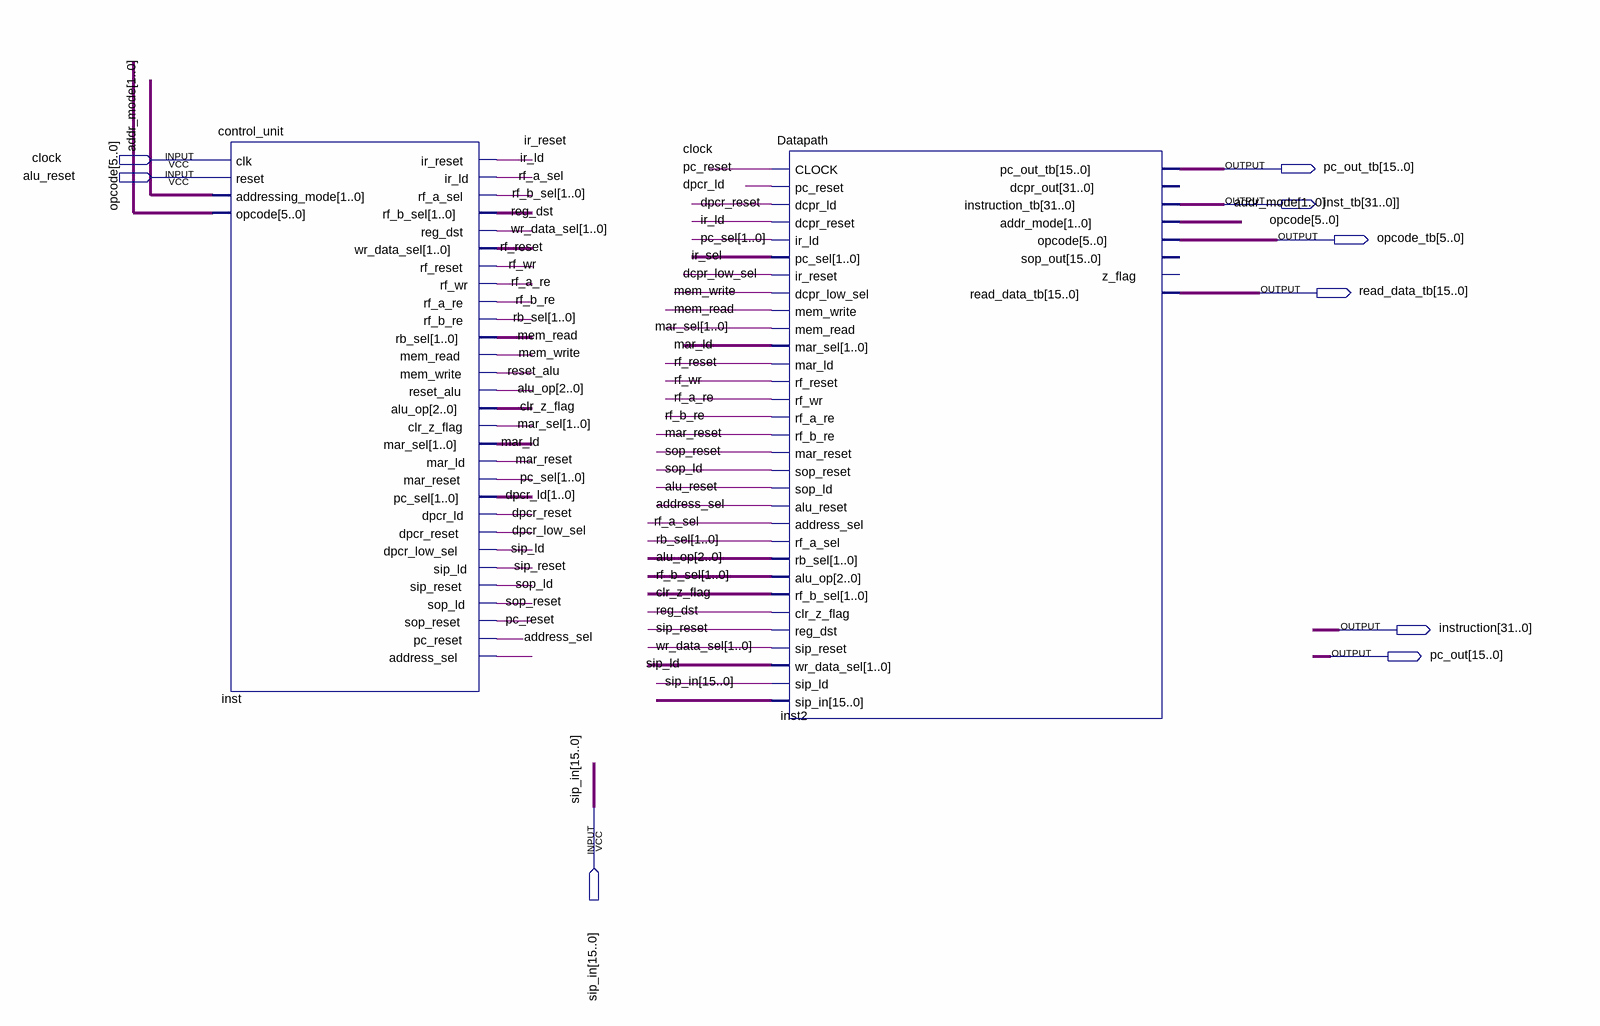
[diagram p0: schematic sheet]
// Quartus schematic ReCOP.bdf as structural Verilog: 2 symbols, 9 pins
module ReCOP (
  input  clock,
  input  alu_reset,
  input  [15:0] sip_in,
  output [15:0] pc_out_tb,
  output \inst_tb[31..0]] ,
  output [5:0] opcode_tb,
  output [15:0] read_data_tb,
  output [31:0] instruction,
  output [15:0] pc_out
);

  wire address_sel, clr_z_flag, dcpr_low_sel, dpcr_ld_1bit, dpcr_low_sel, dpcr_reset, ir_ld, ir_reset,
       ir_sel, mar_ld, mar_reset, mem_read, mem_write, pc_reset, reg_dst, reset_alu, rf_a_re, rf_a_sel,
       rf_b_re, rf_reset, rf_wr, sip_ld, sip_reset, sop_ld, sop_reset;
  wire [1:0] addr_mode, dpcr_ld, mar_sel, pc_sel, rb_sel, rf_b_sel, wr_data_sel;
  wire [2:0] alu_op;
  wire [31:0] inst2_instruction_tb;

  control_unit inst (
    .clk(clock), .reset(alu_reset), .addressing_mode(addr_mode), .opcode(opcode_tb), .ir_reset(ir_reset),
    .ir_ld(ir_ld), .rf_a_sel(rf_a_sel), .rf_b_sel(rf_b_sel), .reg_dst(reg_dst), .wr_data_sel(wr_data_sel),
    .rf_reset(rf_reset), .rf_wr(rf_wr), .rf_a_re(rf_a_re), .rf_b_re(rf_b_re), .rb_sel(rb_sel),
    .mem_read(mem_read), .mem_write(mem_write), .reset_alu(reset_alu), .alu_op(alu_op),
    .clr_z_flag(clr_z_flag), .mar_sel(mar_sel), .mar_ld(mar_ld), .mar_reset(mar_reset), .pc_sel(pc_sel),
    .dpcr_ld(dpcr_ld), .dpcr_reset(dpcr_reset), .dpcr_low_sel(dpcr_low_sel), .sip_ld(sip_ld),
    .sip_reset(sip_reset), .sop_ld(sop_ld), .sop_reset(sop_reset), .pc_reset(pc_reset),
    .address_sel(address_sel));
  Datapath inst2 (
    .CLOCK(clock), .pc_reset(pc_reset), .dcpr_ld(dpcr_ld_1bit), .dcpr_reset(dpcr_reset), .ir_ld(ir_ld),
    .pc_sel(pc_sel), .ir_reset(ir_sel), .dcpr_low_sel(dcpr_low_sel), .mem_write(mem_write),
    .mem_read(mem_read), .mar_sel(mar_sel), .mar_ld(mar_ld), .rf_reset(rf_reset), .rf_wr(rf_wr),
    .rf_a_re(rf_a_re), .rf_b_re(rf_b_re), .mar_reset(mar_reset), .sop_reset(sop_reset), .sop_ld(sop_ld),
    .alu_reset(alu_reset), .address_sel(address_sel), .rf_a_sel(rf_a_sel), .rb_sel(rb_sel), .alu_op(alu_op),
    .rf_b_sel(rf_b_sel), .clr_z_flag(clr_z_flag), .reg_dst(reg_dst), .sip_reset(sip_reset),
    .wr_data_sel(wr_data_sel), .sip_ld(sip_ld), .sip_in(sip_in), .pc_out_tb(pc_out_tb),
    .instruction_tb(inst2_instruction_tb), .addr_mode(addr_mode), .opcode(opcode_tb),
    .read_data_tb(read_data_tb));  // open: dcpr_out, sop_out, z_flag

  // Other names for the same wires on the sheet: opcode[5:0] = opcode_tb
endmodule
